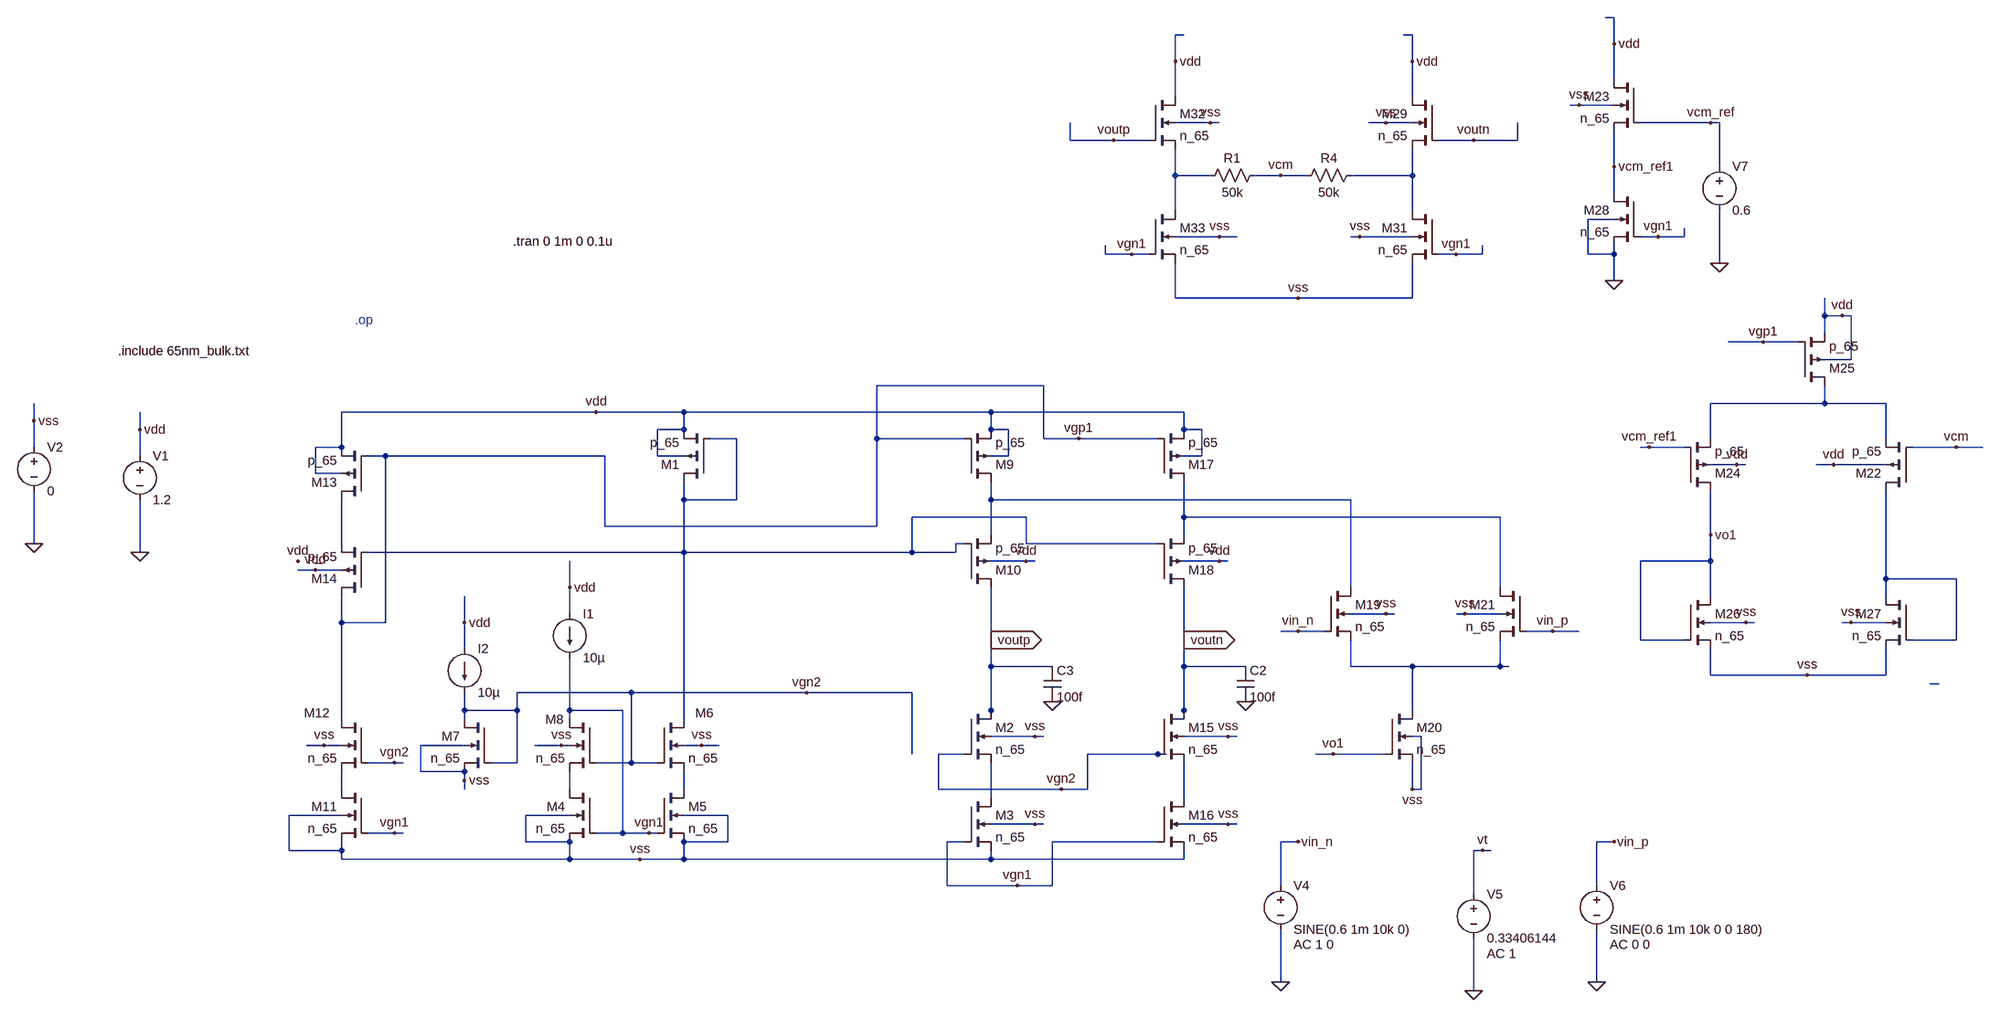
[diagram p0: schematic FC_CD_CMFB.asc]
FC_CD_CMFB.asc, the LTspice schematic file:
Version 4
SHEET 1 2864 756
WIRE 2048 -1040 2032 -1040
WIRE 1264 -1008 1248 -1008
WIRE 1680 -1008 1664 -1008
WIRE 2048 -992 2048 -1040
WIRE 1248 -960 1248 -1008
WIRE 1680 -960 1680 -1008
WIRE 2048 -928 2048 -992
WIRE 1248 -896 1248 -960
WIRE 1680 -896 1680 -960
WIRE 1984 -880 1968 -880
WIRE 2048 -880 1984 -880
WIRE 1312 -848 1248 -848
WIRE 1328 -848 1312 -848
WIRE 1632 -848 1600 -848
WIRE 1680 -848 1632 -848
WIRE 2224 -848 2096 -848
WIRE 2240 -848 2224 -848
WIRE 1056 -816 1056 -848
WIRE 1136 -816 1056 -816
WIRE 1200 -816 1136 -816
WIRE 1792 -816 1728 -816
WIRE 1872 -816 1872 -848
WIRE 1872 -816 1792 -816
WIRE 2048 -768 2048 -832
WIRE 2240 -768 2240 -848
WIRE 1248 -752 1248 -800
WIRE 1312 -752 1248 -752
WIRE 1440 -752 1392 -752
WIRE 1488 -752 1440 -752
WIRE 1680 -752 1680 -800
WIRE 1680 -752 1568 -752
WIRE 2048 -720 2048 -768
WIRE 1248 -688 1248 -752
WIRE 1680 -688 1680 -752
WIRE 2048 -672 2000 -672
WIRE 1328 -640 1248 -640
WIRE 1360 -640 1328 -640
WIRE 1584 -640 1568 -640
WIRE 1680 -640 1584 -640
WIRE 2128 -640 2096 -640
WIRE 2176 -640 2176 -656
WIRE 2176 -640 2128 -640
WIRE 1120 -608 1120 -624
WIRE 1168 -608 1120 -608
WIRE 1200 -608 1168 -608
WIRE 1760 -608 1728 -608
WIRE 1808 -608 1808 -624
WIRE 1808 -608 1760 -608
WIRE 2000 -608 2000 -672
WIRE 2048 -608 2048 -624
WIRE 2048 -608 2000 -608
WIRE 2240 -592 2240 -688
WIRE 2048 -560 2048 -608
WIRE 1248 -528 1248 -592
WIRE 1472 -528 1248 -528
WIRE 1680 -528 1680 -592
WIRE 1680 -528 1472 -528
WIRE 2432 -496 2432 -528
WIRE 2464 -496 2432 -496
WIRE 2480 -496 2464 -496
WIRE 2432 -464 2432 -496
WIRE 2320 -448 2256 -448
WIRE 2384 -448 2320 -448
WIRE 2480 -416 2480 -496
WIRE 2480 -416 2432 -416
WIRE 1008 -368 704 -368
WIRE 2432 -336 2432 -368
WIRE 2432 -336 2224 -336
WIRE 2544 -336 2432 -336
WIRE 192 -320 -272 -320
WIRE 352 -320 192 -320
WIRE 912 -320 352 -320
WIRE 1264 -320 912 -320
WIRE -848 -304 -848 -336
WIRE -640 -288 -640 -320
WIRE 352 -288 352 -320
WIRE 352 -288 304 -288
WIRE 912 -288 912 -320
WIRE 944 -288 912 -288
WIRE 1264 -288 1264 -320
WIRE 1296 -288 1264 -288
WIRE 448 -272 400 -272
WIRE 704 -272 704 -368
WIRE 864 -272 704 -272
WIRE 1008 -272 1008 -368
WIRE 1072 -272 1008 -272
WIRE 1216 -272 1072 -272
WIRE 2224 -272 2224 -336
WIRE 2544 -272 2544 -336
WIRE -848 -256 -848 -304
WIRE -272 -256 -272 -320
WIRE -272 -256 -320 -256
WIRE 2112 -256 2096 -256
WIRE 2176 -256 2112 -256
WIRE 2672 -256 2592 -256
WIRE 2720 -256 2672 -256
WIRE -640 -240 -640 -288
WIRE -272 -240 -272 -256
WIRE -192 -240 -224 -240
WIRE 208 -240 -192 -240
WIRE 304 -240 304 -288
WIRE 352 -240 304 -240
WIRE 944 -240 944 -288
WIRE 944 -240 912 -240
WIRE 1296 -240 1296 -288
WIRE 1296 -240 1264 -240
WIRE 2272 -224 2224 -224
WIRE 2288 -224 2272 -224
WIRE 2448 -224 2416 -224
WIRE 2544 -224 2448 -224
WIRE -320 -208 -320 -256
WIRE -272 -208 -320 -208
WIRE 352 -160 352 -192
WIRE 448 -160 448 -272
WIRE 448 -160 352 -160
WIRE 912 -160 912 -192
WIRE 1568 -160 912 -160
WIRE 976 -128 768 -128
WIRE 1264 -128 1264 -192
WIRE 1840 -128 1264 -128
WIRE 208 -112 208 -240
WIRE 704 -112 704 -272
WIRE 704 -112 208 -112
WIRE 912 -96 912 -160
WIRE 1264 -96 1264 -128
WIRE 2224 -96 2224 -176
WIRE -848 -80 -848 -176
WIRE -272 -80 -272 -160
WIRE 864 -80 848 -80
WIRE 976 -80 976 -128
WIRE 1216 -80 976 -80
WIRE -640 -64 -640 -160
WIRE 352 -64 352 -160
WIRE 352 -64 -224 -64
WIRE 768 -64 768 -128
WIRE 768 -64 352 -64
WIRE 848 -64 848 -80
WIRE 848 -64 768 -64
WIRE 976 -48 912 -48
WIRE 992 -48 976 -48
WIRE 1328 -48 1264 -48
WIRE 1344 -48 1328 -48
WIRE 2224 -48 2224 -96
WIRE 2224 -48 2096 -48
WIRE -320 -32 -352 -32
WIRE -272 -32 -320 -32
WIRE 2544 -16 2544 -176
WIRE 2672 -16 2544 -16
WIRE 144 0 144 -48
WIRE 1568 0 1568 -160
WIRE 1840 0 1840 -128
WIRE 2224 16 2224 -48
WIRE 2544 16 2544 -16
WIRE 144 48 144 0
WIRE 1632 48 1568 48
WIRE 1648 48 1632 48
WIRE 1776 48 1760 48
WIRE 1840 48 1776 48
WIRE -272 64 -272 16
WIRE -192 64 -192 -240
WIRE -192 64 -272 64
WIRE -48 64 -48 16
WIRE 2288 64 2224 64
WIRE 2304 64 2288 64
WIRE 2480 64 2464 64
WIRE 2544 64 2480 64
WIRE 1472 80 1440 80
WIRE 1520 80 1472 80
WIRE 1936 80 1888 80
WIRE 1984 80 1936 80
WIRE 912 96 912 0
WIRE 1264 96 1264 0
WIRE 2096 96 2096 -48
WIRE 2176 96 2096 96
WIRE 2672 96 2672 -16
WIRE 2672 96 2592 96
WIRE -48 112 -48 64
WIRE 912 144 912 96
WIRE 1024 144 912 144
WIRE 1264 144 1264 96
WIRE 1376 144 1264 144
WIRE 1568 144 1568 96
WIRE 1680 144 1568 144
WIRE 1840 144 1840 96
WIRE 1840 144 1680 144
WIRE 1856 144 1840 144
WIRE 2224 160 2224 112
WIRE 2400 160 2224 160
WIRE 2544 160 2544 112
WIRE 2544 160 2400 160
WIRE 2640 176 2624 176
WIRE 256 192 48 192
WIRE 576 192 256 192
WIRE 768 192 576 192
WIRE -48 224 -48 192
WIRE 48 224 48 192
WIRE 48 224 -48 224
WIRE 144 224 144 128
WIRE 240 224 144 224
WIRE 912 224 912 144
WIRE 1264 224 1264 144
WIRE 1680 224 1680 144
WIRE -272 240 -272 64
WIRE -48 240 -48 224
WIRE 144 240 144 224
WIRE 352 240 352 -64
WIRE 912 240 912 224
WIRE 1264 240 1264 224
WIRE 992 272 912 272
WIRE 1008 272 992 272
WIRE 1344 272 1264 272
WIRE 1360 272 1344 272
WIRE 1696 272 1680 272
WIRE -304 288 -336 288
WIRE -272 288 -304 288
WIRE -48 288 -128 288
WIRE 128 288 80 288
WIRE 144 288 128 288
WIRE 384 288 352 288
WIRE 416 288 384 288
WIRE 768 304 768 192
WIRE 864 304 816 304
WIRE 1216 304 1088 304
WIRE 1232 304 1216 304
WIRE 1536 304 1504 304
WIRE 1632 304 1536 304
WIRE -176 320 -224 320
WIRE -160 320 -176 320
WIRE 48 320 48 224
WIRE 48 320 0 320
WIRE 256 320 256 192
WIRE 256 320 192 320
WIRE 304 320 256 320
WIRE -128 336 -128 288
WIRE -48 336 -128 336
WIRE -48 352 -48 336
WIRE -272 368 -272 336
WIRE -48 368 -48 352
WIRE 144 368 144 336
WIRE 352 368 352 336
WIRE 816 368 816 304
WIRE 1040 368 816 368
WIRE 1088 368 1088 304
WIRE 1088 368 1040 368
WIRE 1680 368 1680 320
WIRE 1696 368 1696 272
WIRE 1696 368 1680 368
WIRE 912 384 912 320
WIRE 1264 384 1264 320
WIRE -272 416 -368 416
WIRE 144 416 64 416
WIRE 432 416 352 416
WIRE 992 432 912 432
WIRE 1008 432 992 432
WIRE 1344 432 1264 432
WIRE 1360 432 1344 432
WIRE -176 448 -224 448
WIRE -160 448 -176 448
WIRE 240 448 240 224
WIRE 240 448 192 448
WIRE 288 448 240 448
WIRE 304 448 288 448
WIRE 64 464 64 416
WIRE 144 464 64 464
WIRE 432 464 432 416
WIRE 432 464 352 464
WIRE 864 464 832 464
WIRE 1216 464 1024 464
WIRE 1472 464 1440 464
WIRE 2048 464 2016 464
WIRE -368 480 -368 416
WIRE -272 480 -272 464
WIRE -272 480 -368 480
WIRE 1808 480 1792 480
WIRE 1824 480 1808 480
WIRE -272 496 -272 480
WIRE 144 496 144 464
WIRE 144 496 -272 496
WIRE 272 496 144 496
WIRE 352 496 352 464
WIRE 352 496 272 496
WIRE 912 496 912 480
WIRE 912 496 352 496
WIRE 1264 496 1264 480
WIRE 1264 496 912 496
WIRE 832 544 832 464
WIRE 960 544 832 544
WIRE 1024 544 1024 464
WIRE 1024 544 960 544
WIRE 1440 544 1440 464
WIRE 2016 544 2016 464
WIRE 1792 560 1792 480
WIRE 1440 720 1440 624
WIRE 2016 720 2016 624
WIRE 1792 736 1792 640
FLAG 144 0 vdd
FLAG 992 272 vss
FLAG 992 432 vss
FLAG 384 288 vss
FLAG 272 496 vss
FLAG -48 64 vdd
FLAG -48 352 vss
FLAG 128 288 vss
FLAG 976 -48 vdd
FLAG -304 288 vss
FLAG -176 448 vgn1
FLAG -176 320 vgn2
FLAG 192 -320 vdd
FLAG -640 -64 0
FLAG -640 -288 vdd
FLAG -848 -80 0
FLAG -848 -304 vss
FLAG 912 96 voutp
IOPIN 912 96 Out
FLAG 1344 272 vss
FLAG 1344 432 vss
FLAG 1328 -48 vdd
FLAG 1264 96 voutn
IOPIN 1264 96 Out
FLAG 1632 48 vss
FLAG 1776 48 vss
FLAG 1680 368 vss
FLAG 2400 160 vss
FLAG 2288 64 vss
FLAG 2480 64 vss
FLAG 2464 -496 vdd
FLAG 2272 -224 vdd
FLAG 1936 80 vin_p
FLAG 1472 80 vin_n
FLAG 1072 -272 vgp1
FLAG 1440 720 0
FLAG 1472 464 vin_n
FLAG 1792 736 0
FLAG 2016 720 0
FLAG 2048 464 vin_p
FLAG 1024 208 0
FLAG 1376 208 0
FLAG 576 192 vgn2
FLAG 960 544 vgn1
FLAG 1040 368 vgn2
FLAG 1680 -960 vdd
FLAG 1760 -608 vgn1
FLAG 1792 -816 voutn
FLAG 1248 -960 vdd
FLAG 1168 -608 vgn1
FLAG 1136 -816 voutp
FLAG 1472 -528 vss
FLAG 1440 -752 vcm
FLAG 2448 -224 vdd
FLAG 2672 -256 vcm
FLAG 2320 -448 vgp1
FLAG 288 448 vgn1
FLAG 2048 -992 vdd
FLAG 2128 -640 vgn1
FLAG 2240 -592 0
FLAG 2224 -848 vcm_ref
FLAG 2048 -768 vcm_ref1
FLAG 2112 -256 vcm_ref1
FLAG 2048 -560 0
FLAG 1808 480 vt
FLAG 2224 -96 vo1
FLAG 1536 304 vo1
FLAG -352 -48 vdd
FLAG -320 -32 vdd
FLAG 1312 -848 vss
FLAG 1632 -848 vss
FLAG 1328 -640 vss
FLAG 1584 -640 vss
FLAG 1984 -880 vss
DATAFLAG 688 192 ""
DATAFLAG 768 -64 ""
DATAFLAG 1024 -288 ""
DATAFLAG 1264 -304 ""
DATAFLAG 2272 -336 ""
DATAFLAG 2224 -128 ""
DATAFLAG 2544 -64 ""
DATAFLAG 912 48 ""
DATAFLAG 1264 48 ""
DATAFLAG 2416 96 ""
DATAFLAG 1680 -128 ""
DATAFLAG 992 -160 ""
DATAFLAG 1264 368 ""
DATAFLAG 912 368 ""
DATAFLAG 1680 352 ""
DATAFLAG 880 464 ""
DATAFLAG 1120 -80 ""
DATAFLAG 1104 448 ""
DATAFLAG 1248 -784 ""
DATAFLAG 1680 -768 ""
DATAFLAG 1072 -816 ""
DATAFLAG 1872 -832 ""
DATAFLAG -208 320 ""
DATAFLAG 208 320 ""
DATAFLAG 96 -240 ""
DATAFLAG 48 -64 ""
DATAFLAG -272 -144 ""
DATAFLAG 2160 -864 ""
DATAFLAG 2208 -16 ""
DATAFLAG 1568 -112 ""
DATAFLAG 1680 192 ""
DATAFLAG 1552 288 ""
DATAFLAG 2048 -816 "$"
SYMBOL pmos4 400 -192 R180
SYMATTR InstName M1
SYMATTR Value p_65
SYMATTR Value2 l=200n w=2.5u
SYMBOL nmos4 864 224 R0
SYMATTR InstName M2
SYMATTR Value n_65
SYMATTR Value2 l=200n w=10u
SYMBOL nmos4 864 384 R0
SYMATTR InstName M3
SYMATTR Value n_65
SYMATTR Value2 l=200n w=10u
SYMBOL nmos4 192 368 M0
SYMATTR InstName M4
SYMATTR Value n_65
SYMATTR Value2 l=200n w=10u
SYMBOL current 144 48 R0
WINDOW 123 0 0 Left 0
WINDOW 39 0 0 Left 0
SYMATTR InstName I1
SYMATTR Value 10µ
SYMBOL nmos4 304 368 R0
SYMATTR InstName M5
SYMATTR Value n_65
SYMATTR Value2 l=200n w=10u
SYMBOL nmos4 304 240 R0
WINDOW 0 69 -11 Left 2
SYMATTR InstName M6
SYMATTR Value n_65
SYMATTR Value2 l=200n w=10u
SYMBOL nmos4 0 240 M0
SYMATTR InstName M7
SYMATTR Value n_65
SYMATTR Value2 l=200n w=2.5u
SYMBOL current -48 112 R0
WINDOW 123 0 0 Left 0
WINDOW 39 0 0 Left 0
SYMATTR InstName I2
SYMATTR Value 10µ
SYMBOL nmos4 192 240 M0
WINDOW 0 59 1 Left 2
SYMATTR InstName M8
SYMATTR Value n_65
SYMATTR Value2 l=200n w=10u
SYMBOL pmos4 864 -192 M180
SYMATTR InstName M9
SYMATTR Value p_65
SYMATTR Value2 l=200n w=20u
SYMBOL pmos4 864 0 M180
SYMATTR InstName M10
SYMATTR Value p_65
SYMATTR Value2 l=200n w=10u
SYMBOL nmos4 -224 368 M0
SYMATTR InstName M11
SYMATTR Value n_65
SYMATTR Value2 l=200n w=10u
SYMBOL nmos4 -224 240 M0
WINDOW 0 69 -11 Left 2
SYMATTR InstName M12
SYMATTR Value n_65
SYMATTR Value2 l=200n w=10u
SYMBOL pmos4 -224 -160 R180
SYMATTR InstName M13
SYMATTR Value p_65
SYMATTR Value2 l=200n w=10u
SYMBOL pmos4 -224 16 R180
SYMATTR InstName M14
SYMATTR Value p_65
SYMATTR Value2 l=200n w=10u
SYMBOL voltage -640 -256 R0
WINDOW 123 0 0 Left 0
WINDOW 39 0 0 Left 0
SYMATTR InstName V1
SYMATTR Value 1.2
SYMBOL voltage -848 -272 R0
WINDOW 123 0 0 Left 0
WINDOW 39 0 0 Left 0
SYMATTR InstName V2
SYMATTR Value 0
SYMBOL nmos4 1216 224 R0
SYMATTR InstName M15
SYMATTR Value n_65
SYMATTR Value2 l=200n w=10u
SYMBOL nmos4 1216 384 R0
SYMATTR InstName M16
SYMATTR Value n_65
SYMATTR Value2 l=200n w=10u
SYMBOL pmos4 1216 -192 M180
SYMATTR InstName M17
SYMATTR Value p_65
SYMATTR Value2 l=200n w=20u
SYMBOL pmos4 1216 0 M180
SYMATTR InstName M18
SYMATTR Value p_65
SYMATTR Value2 l=200n w=10u
SYMBOL nmos4 1520 0 R0
SYMATTR InstName M19
SYMATTR Value n_65
SYMATTR Value2 l=200n w=80u
SYMBOL nmos4 1888 0 M0
SYMATTR InstName M21
SYMATTR Value n_65
SYMATTR Value2 l=200n w=80u
SYMBOL nmos4 1632 224 R0
SYMATTR InstName M20
SYMATTR Value n_65
SYMATTR Value2 l=200n w=20u
SYMBOL pmos4 2176 -176 M180
SYMATTR InstName M24
SYMATTR Value p_65
SYMATTR Value2 l=65n w=40u
SYMBOL pmos4 2384 -368 M180
SYMATTR InstName M25
SYMATTR Value p_65
SYMATTR Value2 l=200n w=20u
SYMBOL nmos4 2176 16 R0
SYMATTR InstName M26
SYMATTR Value n_65
SYMATTR Value2 l=200n w=10u
SYMBOL nmos4 2592 16 M0
SYMATTR InstName M27
SYMATTR Value n_65
SYMATTR Value2 l=200n w=10u
SYMBOL voltage 1440 528 R0
WINDOW 123 24 124 Left 2
WINDOW 39 0 0 Left 0
SYMATTR Value2 AC 1 0
SYMATTR InstName V4
SYMATTR Value SINE(0.6 1m 10k 0)
SYMBOL voltage 1792 544 R0
WINDOW 123 24 124 Left 2
WINDOW 39 0 0 Left 0
SYMATTR Value2 AC 1
SYMATTR InstName V5
SYMATTR Value 0.33406144
SYMBOL voltage 2016 528 R0
WINDOW 123 24 124 Left 2
WINDOW 39 0 0 Left 0
SYMATTR Value2 AC 0 0
SYMATTR InstName V6
SYMATTR Value SINE(0.6 1m 10k 0 0 180)
SYMBOL cap 1360 144 R0
SYMATTR InstName C2
SYMATTR Value 100f
SYMBOL cap 1008 144 R0
SYMATTR InstName C3
SYMATTR Value 100f
SYMBOL nmos4 1728 -896 M0
SYMATTR InstName M29
SYMATTR Value n_65
SYMATTR Value2 l=65n w=20u
SYMBOL nmos4 1728 -688 M0
SYMATTR InstName M31
SYMATTR Value n_65
SYMATTR Value2 l=200n w=20u
SYMBOL nmos4 1200 -896 R0
SYMATTR InstName M32
SYMATTR Value n_65
SYMATTR Value2 l=65n w=20u
SYMBOL nmos4 1200 -688 R0
SYMATTR InstName M33
SYMATTR Value n_65
SYMATTR Value2 l=200n w=20u
SYMBOL res 1408 -768 R90
WINDOW 0 0 56 VBottom 2
WINDOW 3 32 56 VTop 2
SYMATTR InstName R1
SYMATTR Value 50k
SYMATTR SpiceLine tol=1 pwr=0.1
SYMBOL res 1584 -768 R90
WINDOW 0 0 56 VBottom 2
WINDOW 3 32 56 VTop 2
SYMATTR InstName R4
SYMATTR Value 50k
SYMATTR SpiceLine tol=1 pwr=0.1
SYMBOL pmos4 2592 -176 R180
SYMATTR InstName M22
SYMATTR Value p_65
SYMATTR Value2 l=65n w=40u
SYMBOL nmos4 2096 -928 M0
SYMATTR InstName M23
SYMATTR Value n_65
SYMATTR Value2 l=65n w=20u
SYMBOL nmos4 2096 -720 M0
SYMATTR InstName M28
SYMATTR Value n_65
SYMATTR Value2 l=200n w=20u
SYMBOL voltage 2240 -784 R0
WINDOW 123 0 0 Left 0
WINDOW 39 0 0 Left 0
SYMATTR InstName V7
SYMATTR Value 0.6
TEXT -680 -432 Left 2 !.include 65nm_bulk.txt
TEXT -248 -488 Left 2 ;.op
TEXT 40 -632 Left 2 !.tran 0 1m 0 0.1u

The netlist it stands for:
* FC_CD_CMFB.asc
M1 N004 N004 vdd vdd p_65 l=200n w=2.5u
M2 voutp vgn2 N014 vss n_65 l=200n w=10u
M3 N014 vgn1 vss vss n_65 l=200n w=10u
M4 N012 vgn1 vss vss n_65 l=200n w=10u
I1 vdd vgn1 10µ
M5 N013 vgn1 vss vss n_65 l=200n w=10u
M6 N004 vgn2 N013 vss n_65 l=200n w=10u
M7 vgn2 vgn2 vss vss n_65 l=200n w=2.5u
I2 vdd vgn2 10µ
M8 vgn1 vgn2 N012 vss n_65 l=200n w=10u
M9 N005 vgp1 vdd vdd p_65 l=200n w=20u
M10 voutp N004 N005 vdd p_65 l=200n w=10u
M11 N011 vgn1 vss vss n_65 l=200n w=10u
M12 vgp1 vgn2 N011 vss n_65 l=200n w=10u
M13 N007 vgp1 vdd vdd p_65 l=200n w=10u
M14 vgp1 N004 N007 vdd p_65 l=200n w=10u
V1 vdd 0 1.2
V2 vss 0 0
M15 voutn vgn2 N015 vss n_65 l=200n w=10u
M16 N015 vgn1 vss vss n_65 l=200n w=10u
M17 N006 vgp1 vdd vdd p_65 l=200n w=20u
M18 voutn N004 N006 vdd p_65 l=200n w=10u
M19 N005 vin_n N009 vss n_65 l=200n w=80u
M21 N006 vin_p N009 vss n_65 l=200n w=80u
M20 N009 vo1 vss vss n_65 l=200n w=20u
M24 vo1 vcm_ref1 N003 vdd p_65 l=65n w=40u
M25 N003 vgp1 vdd vdd p_65 l=200n w=20u
M26 vo1 vo1 vss vss n_65 l=200n w=10u
M27 N008 N008 vss vss n_65 l=200n w=10u
V4 vin_n 0 SINE(0.6 1m 10k 0) AC 1 0
V5 vt 0 0.33406144 AC 1
V6 vin_p 0 SINE(0.6 1m 10k 0 0 180) AC 0 0
C2 voutn 0 100f
C3 voutp 0 100f
M29 vdd voutn N002 vss n_65 l=65n w=20u
M31 N002 vgn1 vss vss n_65 l=200n w=20u
M32 vdd voutp N001 vss n_65 l=65n w=20u
M33 N001 vgn1 vss vss n_65 l=200n w=20u
R1 vcm N001 50k tol=1 pwr=0.1
R4 N002 vcm 50k tol=1 pwr=0.1
M22 N008 vcm N003 vdd p_65 l=65n w=40u
M23 vdd vcm_ref vcm_ref1 vss n_65 l=65n w=20u
M28 vcm_ref1 vgn1 0 0 n_65 l=200n w=20u
V7 vcm_ref 0 0.6
.model NMOS NMOS
.model PMOS PMOS
.lib standard.mos
.include 65nm_bulk.txt
* .op
.tran 0 1m 0 0.1u
.backanno
.end